# EasyEDA Pro project ProProject_powerboard_ssl_philipp_2023-09-25.epro, schematic Schematic1_1

## Sheets
1 P1: Create Date: 2022-11-08; Page Name: P1; Project Name: powerboard_ssl_philipp; Schematic Name: Schematic1_1; Update Date: 2023-04-02; Company: 嘉立创EDA; Page Size: A4; Version: V1.0
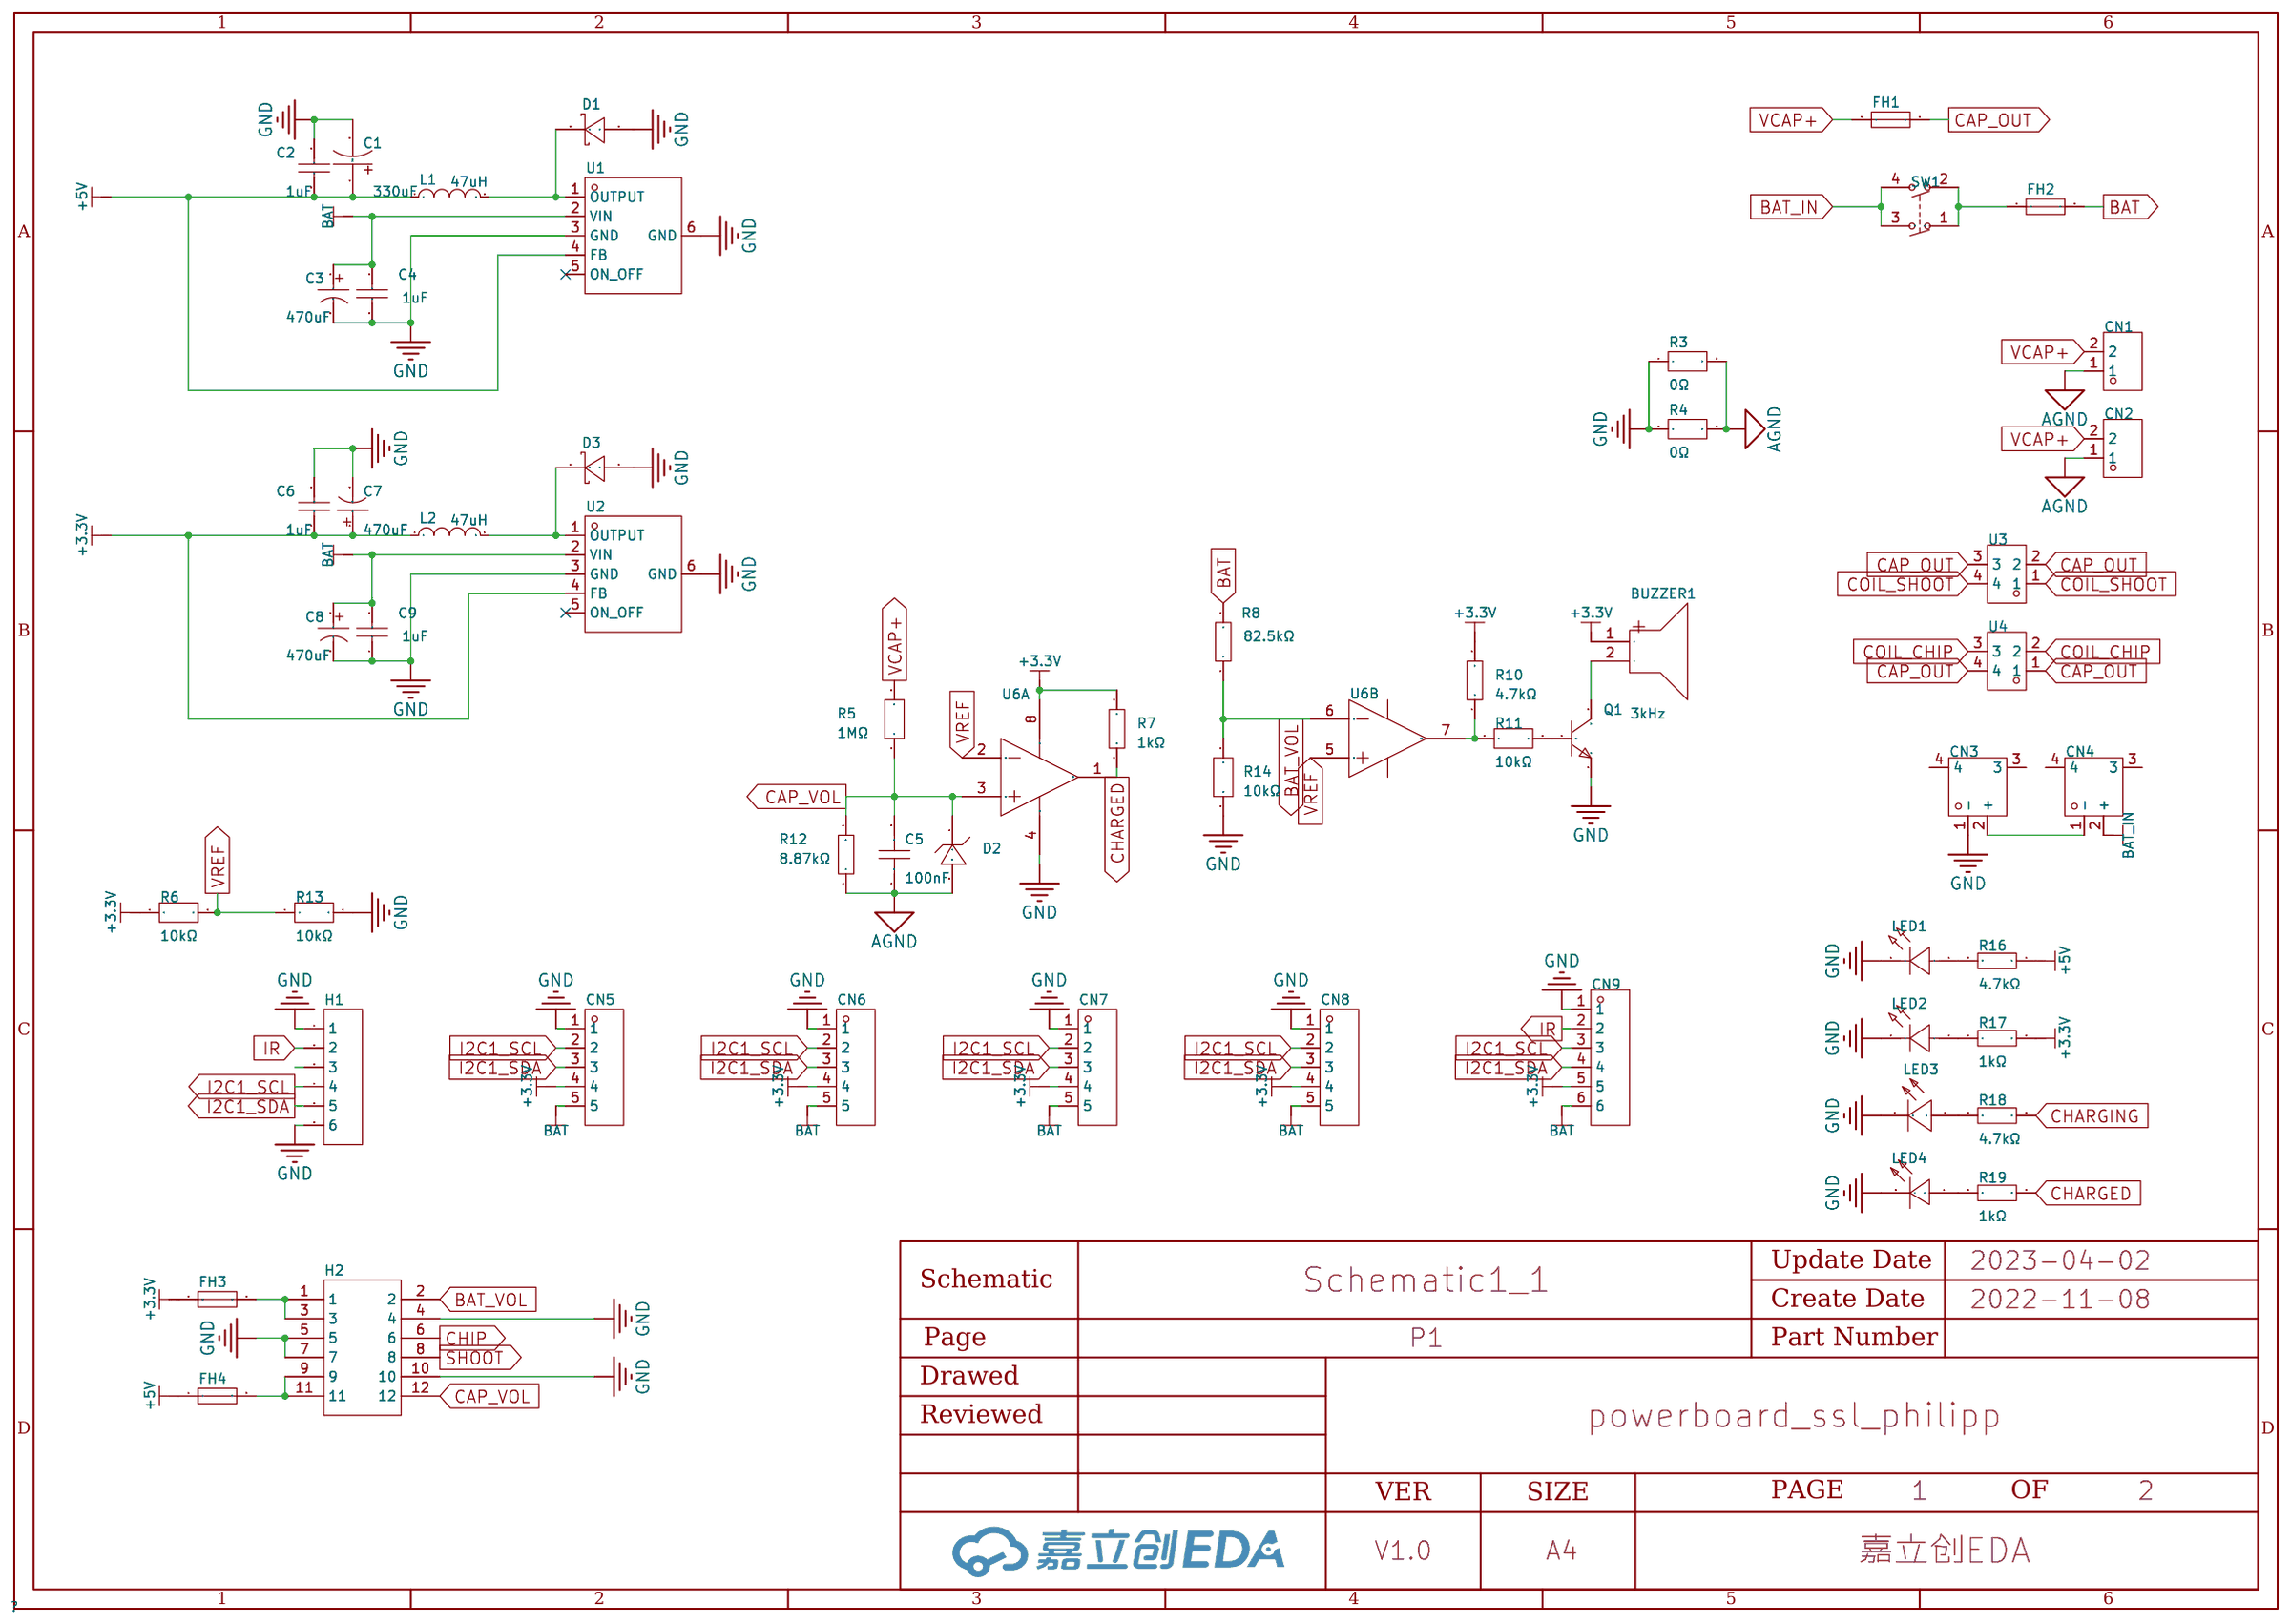
[diagram p16: P1]
2 P2: Create Date: 2022-11-11; Page Name: P2; Update Date: 2023-06-13
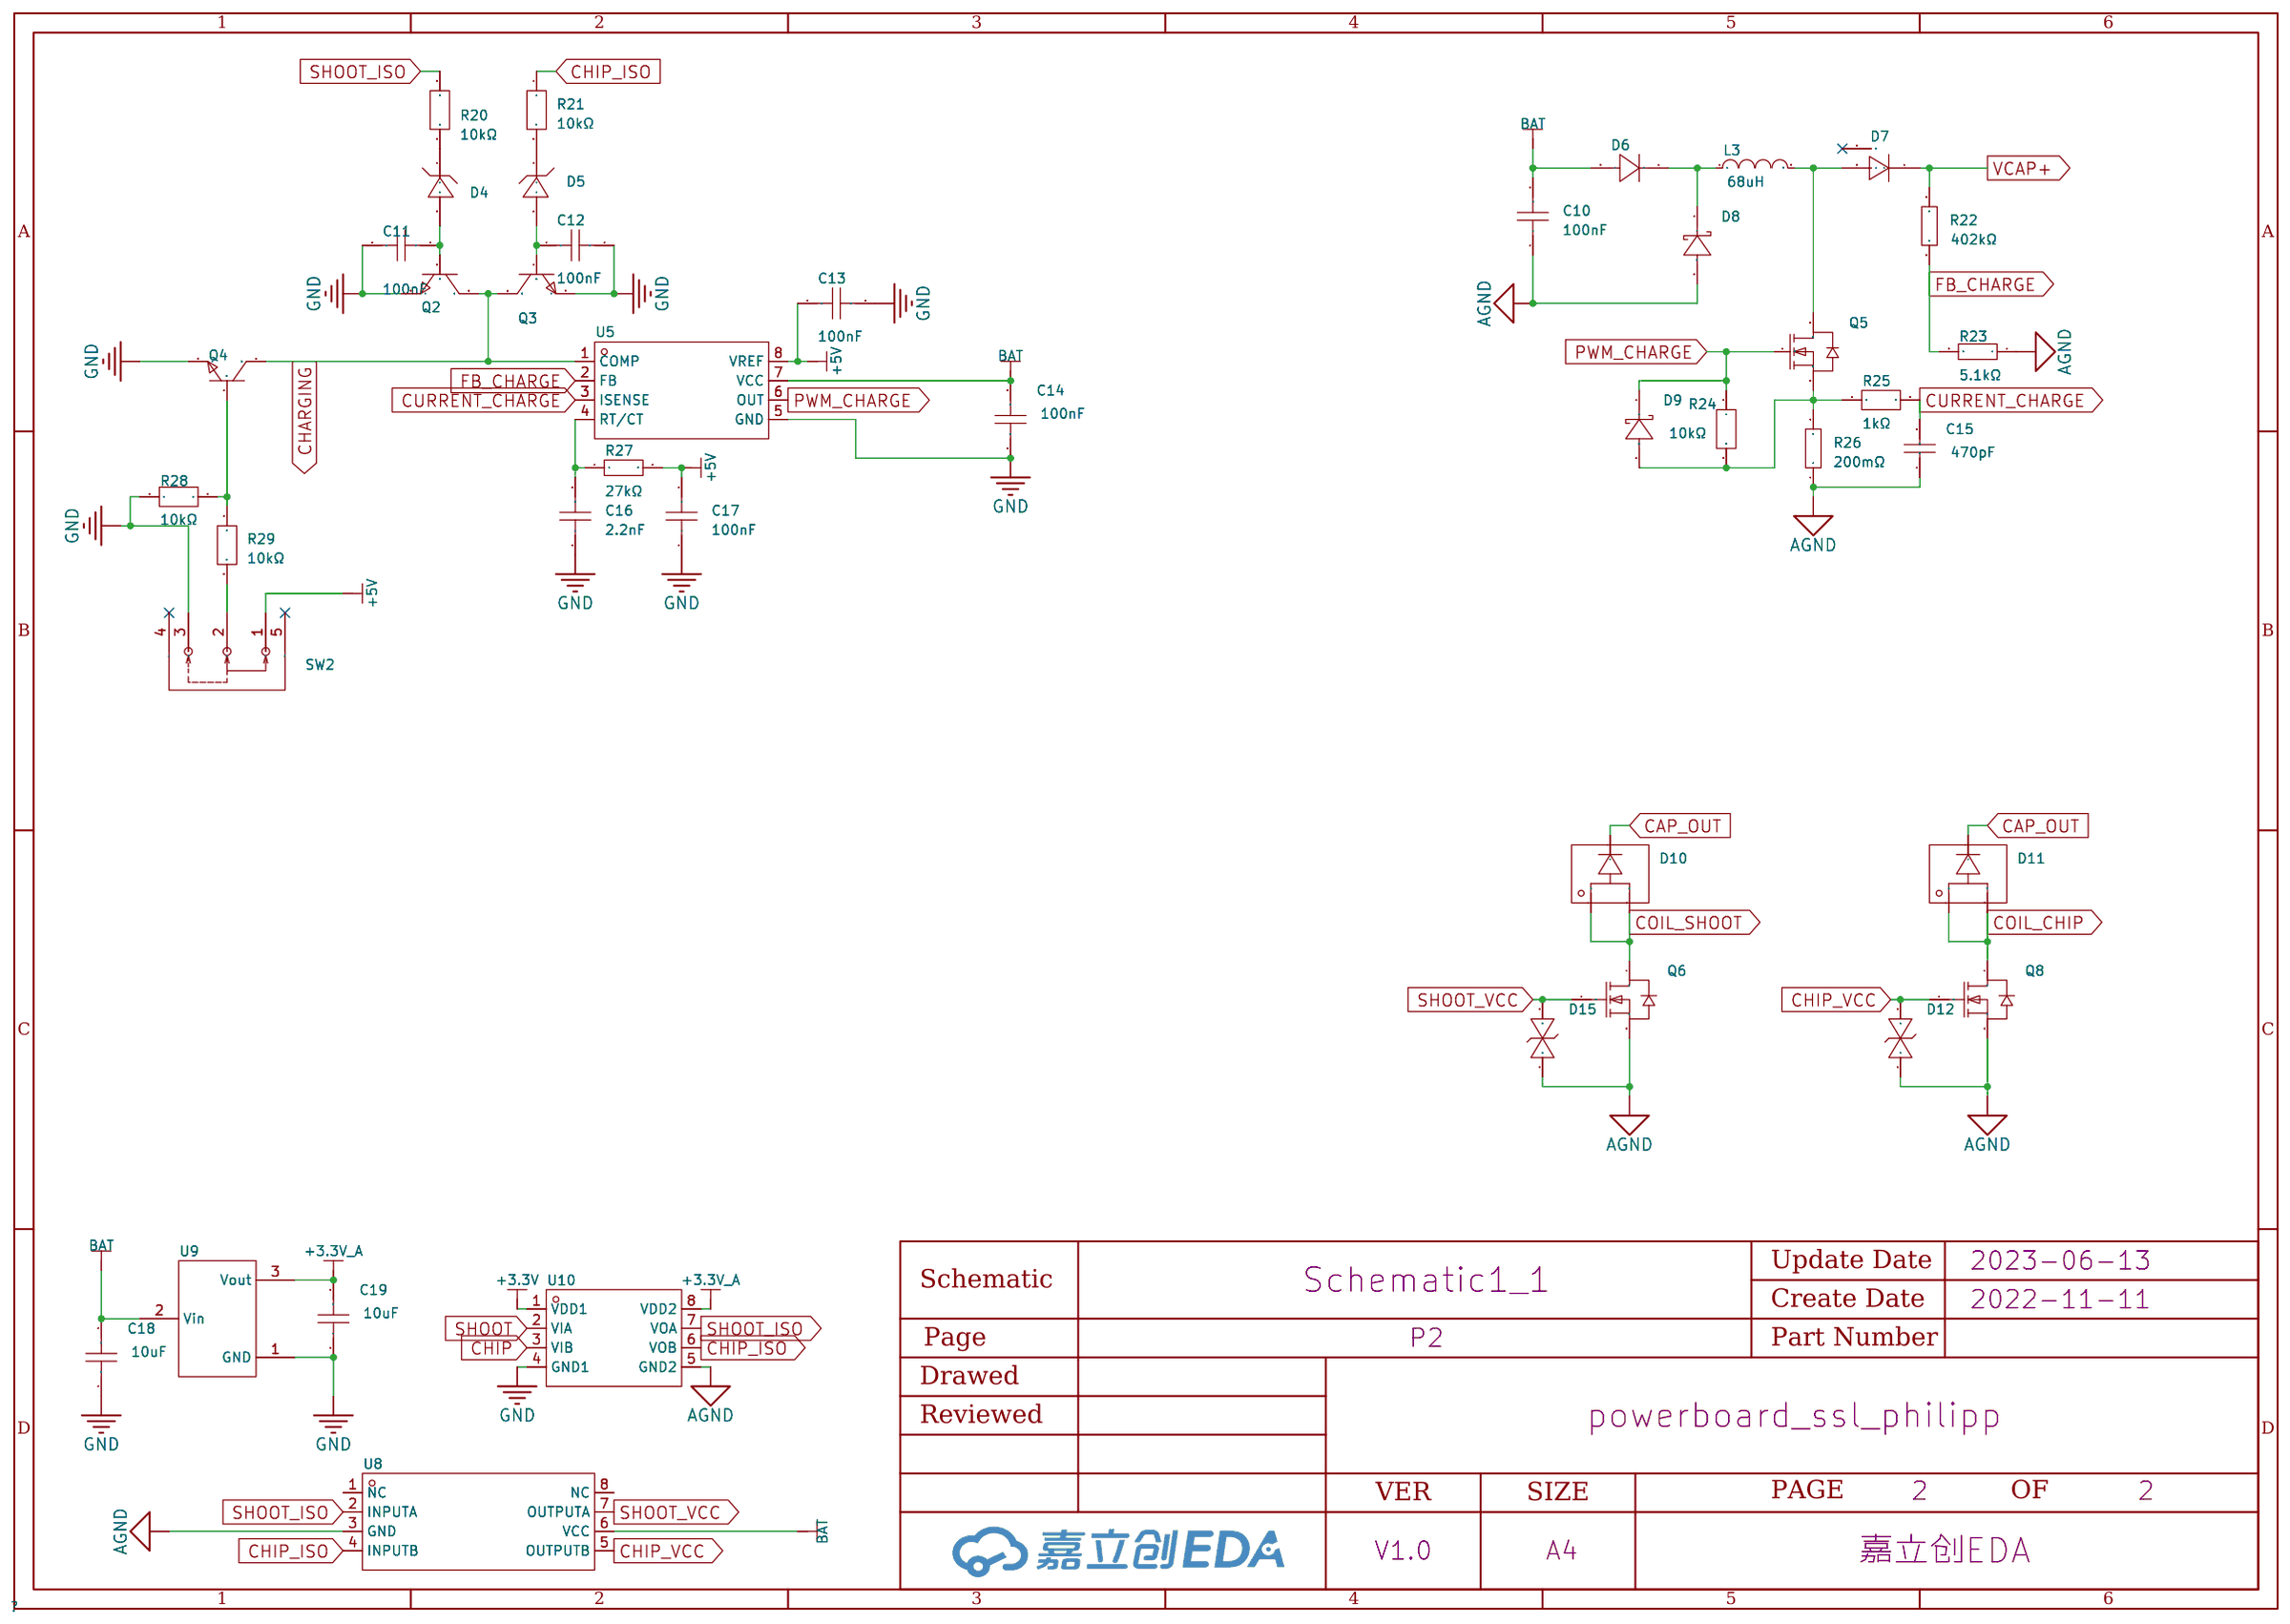
[diagram p17: P2]

## Parts
sheet P1
BUZZER1  3kHz  [BUZ-TH_BD9.0-P5.00-D0.6-FD]
C1  330uF  [CAP-TH_BD8.0-P3.50-D0.6-FD]
C2  1uF  [C0805]
C3  470uF  [CAP-TH_BD10.0-P5.00-D1.0-FD]
C4  1uF  [C0805]
C5  100nF  [C0805]
C6  1uF  [C0805]
C7  470uF  [CAP-TH_BD10.0-P5.00-D1.0-FD]
C8  470uF  [CAP-TH_BD10.0-P5.00-D1.0-FD]
C9  1uF  [C0805]
CN1  OQ0254510000G  [CONN-TH_2P-P25.08_OQ0254510000G]
CN2  OQ0254510000G  [CONN-TH_2P-P25.08_OQ0254510000G]
CN3  XT60PW-M  [CONN-TH_XT60PW-M]
CN4  XT60PW-M  [CONN-TH_XT60PW-M]
CN5  5264-5AWD米色  [CONN-TH_5P-P2.50_5264-5AWD]
CN6  5264-5AWD米色  [CONN-TH_5P-P2.50_5264-5AWD]
CN7  5264-5AWD米色  [CONN-TH_5P-P2.50_5264-5AWD]
CN8  5264-5AWD米色  [CONN-TH_5P-P2.50_5264-5AWD]
CN9  HC-5264-6AW  [CONN-TH_6P-P2.50_HCTL_HC-5264-6AW]
D1  SK32WA  [SOD-123F_L2.8-W1.8-LS3.7-RD]
D2  SMF3.3A  [SOD-123_L2.8-W1.8-LS3.7-RD]
D3  SK32WA  [SOD-123F_L2.8-W1.8-LS3.7-RD]
FH1  01550900M  [FUSE-SMD_L9.8-W5.0]
FH2  01550900M  [FUSE-SMD_L9.8-W5.0]
FH3  01550900M  [FUSE-SMD_L9.8-W5.0]
FH4  01550900M  [FUSE-SMD_L9.8-W5.0]
H1  2.54-1x6P直针  [HDR-TH_6P-P2.54-V-M-1]
H2  A2541WV-2x6P  [HDR-TH_12P-P2.54-V-M-R2-C6-S2.54]
L1  47uH  [IND-SMD_L12.5-W12.5]
L2  47uH  [IND-SMD_L12.5-W12.5]
LED1  MHS171UBCT  [LED-SMD_L2.1-W1.0-R-RD]
LED2  MHS171UBCT  [LED-SMD_L2.1-W1.0-R-RD]
LED3  MHT170UGCT  [LED0805-RD]
LED4  SZYY0805B  [LED0805-R-RD_BLUE]
Q1  SS8050  [SOT-23-3_L2.9-W1.3-P1.90-LS2.4-BR]
R3  0Ω  [R2512]
R4  0Ω  [R2512]
R5  1MΩ  [R0805]
R6  10kΩ  [R0805]
R7  1kΩ  [R0805]
R8  82.5kΩ  [R0805]
R10  4.7kΩ  [R0805]
R11  10kΩ  [R0805]
R12  8.87kΩ  [R0805]
R13  10kΩ  [R0805]
R14  10kΩ  [R0805]
R16  4.7kΩ  [R0805]
R17  1kΩ  [R0805]
R18  4.7kΩ  [R0805]
R19  1kΩ  [R0805]
SW1  SS21-BBIWP2-R  [SW-TH_SS21-BBIWP2]
U1  LM2595S-5.0RG  [TO-263-5_L10.2-W9.9-P1.70-LS14.4-TL]
U2  LM2595S-3.3RG  [TO-263-5_L10.2-W9.9-P1.70-LS14.4-TL]
U3  2061-602/998-404  [CONN-SMD_2061-602-998-404]
U4  2061-602/998-404  [CONN-SMD_2061-602-998-404]
U6  LM393  [SOP-8_L4.9-W3.9-P1.27-LS6.0-BL]  (sections 1,2)
sheet P2
C10  100nF  [C0805]
C11  100nF  [C0805]
C12  100nF  [C0805]
C13  100nF  [C0805]
C14  100nF  [C0805]
C15  470pF  [C1206]
C16  2.2nF  [C1206]
C17  100nF  [C0805]
C18  10uF  [C0805]
C19  10uF  [C0805]
D4  MMSZ9V1T1G  [SOD-123_L2.7-W1.6-LS3.7-RD-3]
D5  MMSZ9V1T1G  [SOD-123_L2.7-W1.6-LS3.7-RD-3]
D6  GS2M  [SMB_L4.5-W3.6-LS5.4-RD]
D7  SFAS805GHMNG  [D2PAK_L10.5-W8.8-P5.08-LS15.2-BL-1]
D8  SMBJ18A  [SMB_L4.4-W3.6-LS5.4-RD]
D9  SMBJ18A  [SMB_L4.4-W3.6-LS5.4-RD]
D10  MBRB40250TG  [D2PAK_L9.1-W10.0-P2.54-LS15.3-BR]
D11  MBRB40250TG  [D2PAK_L9.1-W10.0-P2.54-LS15.3-BR]
D12  SMBJ17CA  [SMB_L4.6-W3.6-LS5.3-BI]
D15  SMBJ17CA  [SMB_L4.6-W3.6-LS5.3-BI]
L3  68uH  [IND-SMD_L12.5-W12.5_SMDRS1255-331M]
Q2  SS8050  [SOT-23-3_L2.9-W1.3-P1.90-LS2.4-BR]
Q3  SS8050  [SOT-23-3_L2.9-W1.3-P1.90-LS2.4-BR]
Q4  SS8050  [SOT-23-3_L2.9-W1.3-P1.90-LS2.4-BR]
Q5  HSU16N25  [TO-252-2_L6.5-W5.6-P4.60-LS9.7-BR-2]
Q6  IRFS4229TRLPBF  [D2PAK_L9.1-W10.0-P2.54-LS15.3-TL]
Q8  IRFS4229TRLPBF  [D2PAK_L9.1-W10.0-P2.54-LS15.3-TL]
R20  10kΩ  [R0805]
R21  10kΩ  [R0805]
R22  402kΩ  [R1206]
R23  5.1kΩ  [R1206]
R24  10kΩ  [R0805]
R25  1kΩ  [R1206]
R26  200mΩ  [R1206]
R27  27kΩ  [R1206]
R28  10kΩ  [R0805]
R29  10kΩ  [R0805]
SW2  SK12D07VG4  [SW-TH_SK12D07VG4]
U5  UC3842B  [SOP-8_L4.9-W3.9-P1.27-LS6.0-BL-1]
U8  MC34152DG  [SOIC-8_L5.0-W4.0-P1.27-LS6.0-BL]
U9  HT7533-1  [SOT-89-3_L4.5-W2.5-P1.50-LS4.2-BR]
U10  120U30  [SOIC-8_L5.0-W4.0-P1.27-LS6.0-BL]

## Library data of the parts
BUZZER1 = HNB09A03: 驱动方式:电磁式;构造类型:有源;额定电压:3V;工作电压:1.5V~4.5V;消耗电流:30mA;频率:3kHz;声压(SPL):85dB@10cm;直径(φD):9mm;长度:-;宽度:-;高度:5.5mm;工作温度:-20~+70;; LCSC Part Name: 电磁式有源一体蜂鸣器HNB09A03; Supplier Part: C96102; Manufacturer: 华能; Supplier Footprint: 插件,P=5mm; JLCPCB Part Class: Extended Part; Datasheet: https://atta.szlcsc.com/upload/public/pdf/source/20170522/1495448326172.pdf; Supplier: LCSC; Oscillator Circuit: 电磁式; Technology Type: 有源; Rated Voltage: 3V; Operating Voltage: 1.5V~4.5V; Current Consumption: 30mA; Sound Pressure Level (SPL): 85dB@10cm; Diameter (φD): 9mm; Height: 5.5mm; Operating Temperature: -20~+70
C1 = EEUFR1E331: 容值:330uF;精度:±20%;额定电压:25V;电容体直径:8mm;电容体长度:11.5mm;脚间距:3.5mm;纹波电流:950mA@100kHz;等效串联电阻:56mΩ@100kHz;工作寿命:6000hrs@105;; LCSC Part Name: 330uF ±20% 25V; Supplier Part: C407891; Manufacturer: PANASONIC(松下); Supplier Footprint: 径向引线,8x11.5mm; JLCPCB Part Class: Extended Part; Datasheet: https://atta.szlcsc.com/upload/public/pdf/source/20190724/C407891_5CA8D9DEE0001D41EB2C74189911EB5A.pdf; Supplier: LCSC; Tolerance: ±20%; Rated Voltage: 25V; φD: 8mm; L: 11.5mm; Lead Spacing: 3.5mm; Ripple Current: 950mA@100kHz; Equivalent Series Resistance(ESR): 56mΩ@100kHz; Lifetime @ Temp: 6000hrs@105
C2 C4 C6 C9 = CL21F105ZAFNNNE: 容值:1uF;精度:-20%~+80%;额定电压:25V;材质(温度系数):Y5V;; LCSC Part Name: 1uF -20%~+80% 25V; Supplier Part: C1761; Manufacturer: SAMSUNG(三星); Supplier Footprint: 0805; JLCPCB Part Class: Extended Part; Datasheet: https://atta.szlcsc.com/upload/public/pdf/source/20160103/1457707695493.pdf; Supplier: LCSC; Tolerance: -20%~+80%; Voltage Rated: 25V; Temperature Coefficient: Y5V
C3 C7 C8 = 25ZLH470MEFC10X12.5: 容值:470uF;精度:±20%;额定电压:25V;电容体直径:10mm;电容体长度:12.5mm;脚间距:5mm;纹波电流:1.33A@100kHz;等效串联电阻:39mΩ@100kHz;工作寿命:10000hrs@105;; LCSC Part Name: 470uF ±20% 25V; Supplier Part: C338188; Manufacturer: rubycon(红宝石); Supplier Footprint: 径向引线,10x12.5mm; JLCPCB Part Class: Extended Part; Datasheet: https://atta.szlcsc.com/upload/public/pdf/source/20181130/C338188_1702E32D76EB3A3EA3A8AEBC54AD098D.pdf; Supplier: LCSC; Tolerance: ±20%; Rated Voltage: 25V; φD: 10mm; L: 12.5mm; Lead Spacing: 5mm; Ripple Current: 1.33A@100kHz; Equivalent Series Resistance(ESR): 39mΩ@100kHz; Lifetime @ Temp: 10000hrs@105
C5 C10-C14 C17 = C0805X104K101T: 温度系数:X7R;容值:100nF;精度:±10%;额定电压:100V;; LCSC Part Name: 100nF(104) ±10% 100V; Supplier Part: C485772; Manufacturer: IHHEC(禾伸堂); Supplier Footprint: 0805; JLCPCB Part Class: Extended Part; Datasheet: https://atta.szlcsc.com/upload/public/pdf/source/20200117/C485772_1C2A03D89DC7D3F931FB9AFBA2903E68.pdf; Supplier: LCSC; Temperature Coefficient: X7R; Tolerance: ±10%; Voltage Rated: 100V
CN1 CN2 = OQ0254510000G: 参考系列:-;间距:5.08mm;插针结构:1x2P;排数:1;每排PIN数:2;行距:-;公母:公型插针;安装方式:弯插;额定电流:20A;工作温度范围:-40~+115;; LCSC Part Name: 2P 5.08mm; Supplier Part: C599410; Manufacturer: Amphenol; Supplier Footprint: 插件,P=5.08mm; JLCPCB Part Class: Extended Part; Datasheet: https://atta.szlcsc.com/upload/public/pdf/source/20210316/C599410_EA23387B2F1C07023878CDA6296B3C6F.pdf; Supplier: LCSC; Pitch: 5.08mm; Pins Structure: 1x2P; Number of Rows: 1; Number of PINs Per Row: 2; Gender: 公型插针; Mounting Style: 弯插; Current Rating (Max): 20A; Operating Temperature Range: -40~+115
CN3 CN4 = XT60PW-M: 模型锂电连接器; LCSC Part Name: XT60PW 公头 板插卧式; Supplier Part: C98732; Manufacturer: AMASS(艾迈斯); Supplier Footprint: Through Hole; JLCPCB Part Class: Extended Part; Datasheet: https://atta.szlcsc.com/upload/public/pdf/source/20180125/C98732_15168617837851301983.pdf; Supplier: LCSC
CN5-CN8 = 5264-5AWD米色: 参考系列:-;间距:2.5mm;插针结构:1x5P;排数:1;每排PIN数:5;行距:-;安装方式:-;触头材质:磷青铜;; LCSC Part Name: 5264插座 1*5P 弯针 带定位; Supplier Part: C176652; Manufacturer: BOOMELE(博穆精密); Supplier Footprint: 插件,P=2.5mm; JLCPCB Part Class: Extended Part; Datasheet: https://atta.szlcsc.com/upload/public/pdf/source/20180125/C176652_15168701824541304803.pdf; Supplier: LCSC; Pitch: 2.5mm; Pins Structure: 1x5P; Number of Rows: 1; Number of PINs Per Row: 5; Contact Material: 磷青铜
CN9 = HC-5264-6AW: 参考系列:-;间距:2.5mm;插针结构:1x6P;排数:1;每排PIN数:6;行距:-;公母:公型插针;安装方式:弯插;额定电流:3A;工作温度范围:-25~+85;; LCSC Part Name: 2.5mm 1x6P 弯插; Supplier Part: C2845829; Manufacturer: HCTL(华灿天禄); Supplier Footprint: 弯插,P=2.5mm; JLCPCB Part Class: Extended Part; Datasheet: https://atta.szlcsc.com/upload/public/pdf/source/20210728/C2845825_8A371A7E0B3DBB1209B365938FCC7945.pdf; Supplier: LCSC; Pitch: 2.5mm; Pins Structure: 1x6P; Number of Rows: 1; Number of PINs Per Row: 6; Gender: 公型插针; Mounting Style: 弯插; Current Rating (Max): 3A; Operating Temperature Range: -25~+85
D1 D3 = SK32WA: 直流反向耐压(Vr):20V;平均整流电流(Io):3A;正向压降(Vf):550mV@3A;; LCSC Part Name: 20V 3A 550mV@3A; Supplier Part: C183472; Manufacturer: SHIKUES(时科); Supplier Footprint: SOD-123F; JLCPCB Part Class: Extended Part; Datasheet: https://atta.szlcsc.com/upload/public/pdf/source/20180323/DA73144C84EC669030D5D10416970BB4.pdf; Supplier: LCSC; Reverse Voltage (Vr): 20V; Average Rectified Current (Io): 3A; Forward Voltage (Vf@If): 550mV@3A
D2 = SMF3.3A: 极性:单向;反向截止电压(Vrwm):3.3V;击穿电压(最小值):5.2V;击穿电压(最大值):6V;反向漏电流(Ir):600A;峰值脉冲电流(Ipp)@10/1000s:25A;最大钳位电压:8V;峰值脉冲功率(Ppp)@10/1000s:200W;; LCSC Part Name: 单向 3.3V 200W; Supplier Part: C283866; Manufacturer: DOWO(东沃); Supplier Footprint: SOD-123; JLCPCB Part Class: Extended Part; Datasheet: https://atta.szlcsc.com/upload/public/pdf/source/20180913/C283866_6B3FC7DB82D40F63EC323F6A8CE1774A.pdf; Supplier: LCSC; Polarity: 单向; Reverse Stand-Off Voltage (Vrwm): 3.3V; Breakdown Voltage (Min): 5.2V; Breakdown Voltage (Max): 6V; Reverse Leakage Current (Ir): 600A; Peak Pulse Current (Ipp)@10/1000μs: 25A; Maximum Clamping Voltage: 8V; Peak Pulse Power Dissipation (Ppp)@10/1000μs: 200W
FH1-FH4 = 01550900M: 保险丝座类型:-;保险丝类型:-;配套使用产品/相关产品:-;保险丝尺寸:-;电路数:-;; Supplier Part: C108518; Manufacturer: Littelfuse(美国力特); Supplier Footprint: SMD,9.73x5.03mm; JLCPCB Part Class: Extended Part; Datasheet: https://atta.szlcsc.com/upload/public/pdf/source/20180709/C108518_633006668DA33DEF5C52F8FE2F1C83D6.pdf; Supplier: LCSC
H1 = 2.54-1x6P直针: 间距:2.54mm;总PIN位数:6;排数:1;插针结构:1x6P;行距:-;安装类型:直插;圆针/方针:方针;额定电流:3A;额定电压:-;配合针长度:-;塑高:-;触头材质:黄铜;触头镀层:-;工作温度范围:-40~+105;颜色:黑色;; LCSC Part Name: 2.54mm 1x6P 直插 方针; Supplier Part: C37208; Manufacturer: BOOMELE(博穆精密); Supplier Footprint: 直插,P=2.54mm; JLCPCB Part Class: Extended Part; Datasheet: https://atta.szlcsc.com/upload/public/pdf/source/20151109/1457707558014.pdf; Supplier: LCSC; Pitch: 2.54mm; Number of Pins: 6; Number of Rows: 1; Pin Structure: 1x6P; Mounting Type: 直插; Circluar Pins/Square Pins: 方针; Current Rating (Max): 3A; Contact Material: 黄铜; Operating Temperature Range: -40~+105; Color: 黑色
H2 = A2541WV-2x6P: 间距:2.54mm;总PIN位数:12;排数:2;插针结构:2x6P;行距:2.54mm;安装类型:直插;圆针/方针:方针;额定电流:-;额定电压:-;配合针长度:6mm;塑高:2.54mm;端接针长度:3mm;触头材质:黄铜;触头镀层:-;工作温度范围:-40~+105;颜色:黑色;; LCSC Part Name: 2.54mm 2x6P 直插 方针 镀金; Supplier Part: C225521; Manufacturer: CJT(长江连接器); Supplier Footprint: 插件,P=2.54mm; JLCPCB Part Class: Extended Part; Datasheet: https://atta.szlcsc.com/upload/public/pdf/source/20180509/C225521_5ACF74447E0551B122D29D93138E3088.pdf; Supplier: LCSC; Pitch: 2.54mm; Number of Pins: 12; Number of Rows: 2; Pin Structure: 2x6P; Row Spacing: 2.54mm; Mounting Type: 直插; Circluar Pins/Square Pins: 方针; Length of Mating Pin: 6mm; Insulation Height: 2.54mm; Length of End Connection Pin: 3mm; Contact Material: 黄铜; Operating Temperature Range: -40~+105; Color: 黑色
L1 L2 = MBH125-470M: 电感值:47uH;; Supplier Part: C2981394; Manufacturer: COILMX(迈翔科技); Supplier Footprint: SMD,12.5x12.5x6mm; JLCPCB Part Class: Extended Part; Datasheet: https://atta.szlcsc.com/upload/public/pdf/source/20220311/55EE69307157DBD1A26B3C01E18946AF.pdf; Supplier: LCSC
LED1 LED2 = MHS171UBCT: 发光颜色:蓝灯;二极管配置:-;透镜颜色:无色透明;主波长:467nm~476nm;峰值波长:468nm;色温:-;光通量(25时):-;测试电流:5mA;正向电压(VF):3.1V;发光强度:90mcd;功率:75mW;发光角度:140°;安装方式:侧贴;工作温度:-40~+85;; LCSC Part Name: 0805侧贴蓝色光; Supplier Part: C693906; Manufacturer: MEIHUA(美华); Supplier Footprint: 0805; JLCPCB Part Class: Extended Part; Datasheet: https://atta.szlcsc.com/upload/public/pdf/source/20200629/C693906_2892460FD04527E9A85093334938F5D1.pdf; Supplier: LCSC; Emitted Color: 蓝灯; Lens Color: 无色透明; Dominant Wavelength: 467nm~476nm; Peak Wavelength: 468nm; Forward Current: 5mA; Forward Voltage (VF): 3.1V; Luminous Intensity: 90mcd; Power Dissipation: 75mW; Viewing Angle: 140°; Mounting Sytle: 侧贴; Operating Temperature: -40~+85
LED3 = MHT170UGCT: 发光颜色:翠绿;二极管配置:-;透镜颜色:无色透明;主波长:517.5nm~527.5nm;峰值波长:518nm;色温:-;光通量(25时):-;测试电流:20mA;正向电压(VF):3.3V;发光强度:900mcd;功率:95mW;发光角度:140°;安装方式:-;工作温度:-40~+85;; LCSC Part Name: 0805正贴翠绿色光1.1T; Supplier Part: C397047; Manufacturer: MEIHUA(美华); Supplier Footprint: 0805; JLCPCB Part Class: Extended Part; Datasheet: https://atta.szlcsc.com/upload/public/pdf/source/20190613/C397047_2A22FA6439BE28969F43FCCFADF75FF7.pdf; Supplier: LCSC; Emitted Color: 翠绿; Lens Color: 无色透明; Dominant Wavelength: 517.5nm~527.5nm; Peak Wavelength: 518nm; Forward Current: 20mA; Forward Voltage (VF): 3.3V; Luminous Intensity: 900mcd; Power Dissipation: 95mW; Viewing Angle: 140°; Operating Temperature: -40~+85
LED4 = SZYY0805B: 发光颜色:蓝灯;二极管配置:-;透镜颜色:无色透明;主波长:460nm~475nm;峰值波长:469nm;色温:-;光通量(25时):-;测试电流:5mA;正向电压(VF):3.1V;发光强度:100mcd;功率:100mW;发光角度:120°;安装方式:-;工作温度:-40~+85;; LCSC Part Name: 蓝灯; Supplier Part: C434433; Manufacturer: yongyu(永裕光电); Supplier Footprint: 0805; JLCPCB Part Class: Extended Part; Datasheet: https://atta.szlcsc.com/upload/public/pdf/source/20191204/C434433_0B90CAB876449C52BDD12D5E48F83BBD.pdf; Supplier: LCSC; Emitted Color: 蓝灯; Lens Color: 无色透明; Dominant Wavelength: 460nm~475nm; Peak Wavelength: 469nm; Forward Current: 5mA; Forward Voltage (VF): 3.1V; Luminous Intensity: 100mcd; Power Dissipation: 100mW; Viewing Angle: 120°; Operating Temperature: -40~+85
Q1-Q4 = SS8050_C2150: 晶体管类型:NPN;集射极击穿电压(Vceo):25V;集电极电流(Ic):1.5A;功率(Pd):300mW;集电极-发射极饱和电压(VCE(sat)@Ic,Ib):500mV@800mA,80mA;直流电流增益(hFE@Ic,Vce):200@100mA,1V;特征频率(fT):100MHz;工作温度:+150@(Tj);; LCSC Part Name: SS8050 Y1 200-350 Y1 200-350; Supplier Part: C2150; Manufacturer: CJ(江苏长电/长晶); Supplier Footprint: SOT-23(SOT-23-3); JLCPCB Part Class: Basic Part; Datasheet: https://atta.szlcsc.com/upload/public/pdf/source/20140809/1457707209319.pdf; Supplier: LCSC; Transistor Type: NPN; Collector-Emitter Breakdown Voltage (Vceo): 25V; Collector Current (Ic): 1.5A; Power Dissipation (Pd): 300mW; Collector-Emitter Saturation Voltage (VCE(sat)@Ic,Ib): 500mV@800mA,80mA; DC Current Gain (hFE@Ic,Vce): 200@100mA,1V; Transition Frequency (fT): 100MHz; Operating Temperature: +150@(Tj)
R3 R4 = RC-120000FT: 阻值:0Ω;; Supplier Part: C723334; Manufacturer: FH(风华); Supplier Footprint: 2512; JLCPCB Part Class: Extended Part; Datasheet: https://atta.szlcsc.com/upload/public/pdf/source/20201030/C723334_CEBDDAA37AC0E15E2289D0B9B7A9F653.pdf; Supplier: LCSC
R5 = CR0805F1M00P05Z: 阻值:1MΩ;精度:±1%;功率:125mW;温度系数:±100ppm/;; LCSC Part Name: 1MΩ ±1% 125mW; Supplier Part: C881016; Manufacturer: EVER OHMS(天二科技); Supplier Footprint: 0805; JLCPCB Part Class: Extended Part; Datasheet: https://atta.szlcsc.com/upload/public/pdf/source/20201014/C881429_ABC29D63C8D6A11EB63D87348B25AA7B.pdf; Supplier: LCSC; Tolerance: ±1%; Power(Watts): 125mW; Temperature Coefficient: ±100ppm/
R6 R11 R13 R14 R20 R21 R24 R28 R29 = ARG05FTD1002: 阻值:10kΩ;精度:±1%;温度系数:±50ppm/;; LCSC Part Name: 10kΩ ±1%; Supplier Part: C2828859; Manufacturer: Viking(光颉); Supplier Footprint: 0805; JLCPCB Part Class: Extended Part; Datasheet: https://atta.szlcsc.com/upload/public/pdf/source/20200117/C485675_99063924B4564AF910B7BE66DA8EFA49.pdf; Supplier: LCSC; Tolerance: ±1%; Temperature Coefficient: ±50ppm/
R7 R17 R19 = QR0805F1K00P05Z: 电阻类型:厚膜电阻;阻值:1kΩ;精度:±1%;功率:125mW;温度系数:±100ppm/;最大工作电压:150V;工作温度范围:-55~+155;; LCSC Part Name: 1kΩ ±1%; Supplier Part: C176197; Manufacturer: EVER OHMS(天二科技); Supplier Footprint: 0805; JLCPCB Part Class: Extended Part; Datasheet: https://atta.szlcsc.com/upload/public/pdf/source/20190415/C176197_C60CBF18F0A7636F3DFA0D4EFA05F988.pdf; Supplier: LCSC; Type: 厚膜电阻; Tolerance: ±1%; Power(Watts): 125mW; Temperature Coefficient: ±100ppm/; Overload Voltage (Max): 150V; Operating Temperature Range: -55~+155
R8 = 0805W8F8252T5E: 电阻类型:厚膜电阻;阻值:82.5kΩ;精度:±1%;功率:125mW;温度系数:±100ppm/;最大工作电压:150V;工作温度范围:-55~+155;; LCSC Part Name: 82.5kΩ ±1% 125mW; Supplier Part: C17835; Manufacturer: UNI-ROYAL(厚声); Supplier Footprint: 0805; JLCPCB Part Class: Extended Part; Datasheet: https://atta.szlcsc.com/upload/public/pdf/source/20200306/C422600_1E6D84923E4A46A82E41ADD87F860B5C.pdf; Supplier: LCSC; Type: 厚膜电阻; Tolerance: ±1%; Power(Watts): 125mW; Temperature Coefficient: ±100ppm/; Overload Voltage (Max): 150V; Operating Temperature Range: -55~+155
R10 R16 R18 = RMC08054.7K1%N: 阻值:4.7kΩ;精度:±1%;功率:125mW;; LCSC Part Name: 4.7kΩ ±1% 125mW; Supplier Part: C269746; Manufacturer: Tyohm(幸亚电阻); Supplier Footprint: 0805; JLCPCB Part Class: Extended Part; Datasheet: https://atta.szlcsc.com/upload/public/pdf/source/20190115/C269746_3EA3C7E4490C68712FA44CA03852E2BD.pdf; Supplier: LCSC; Tolerance: ±1%; Power(Watts): 125mW
R12 = RTT058871FTP: 电阻类型:厚膜电阻;阻值:8.87kΩ;精度:±1%;功率:125mW;温度系数:±100ppm/;最大工作电压:150V;工作温度范围:-55~+155;; LCSC Part Name: 8.87kΩ ±1% 125mW; Supplier Part: C104543; Manufacturer: RALEC(旺诠); Supplier Footprint: 0805; JLCPCB Part Class: Extended Part; Datasheet: https://atta.szlcsc.com/upload/public/pdf/source/20170408/1491646636381.pdf; Supplier: LCSC; Type: 厚膜电阻; Tolerance: ±1%; Power(Watts): 125mW; Temperature Coefficient: ±100ppm/; Overload Voltage (Max): 150V; Operating Temperature Range: -55~+155
SW1 = SS21-BBIWP2-R: LCSC Part Name: 跷板开关DPST 15x21mm; Supplier Part: C309182; Manufacturer: Legion(六钧); Supplier Footprint: 插件; JLCPCB Part Class: Extended Part; Datasheet: https://atta.szlcsc.com/upload/public/pdf/source/20190311/C309182_BE3155CDE2291F8D537E9264D9294CC5.pdf; Supplier: LCSC
U1 = LM2595S-5.0RG: 输出电压:5V;输出电流(最大值):3A;开关频率:150kHz;; LCSC Part Name: Vout=5V 3A; Supplier Part: C5145315; Manufacturer: HGC(深圳汉芯); Supplier Footprint: TO-263-5L; Datasheet: https://atta.szlcsc.com/upload/public/pdf/source/20221014/41DB573108F8F48E0FF3640935E27223.pdf; Supplier: LCSC; Output Voltage: 5V; Output Current (Max): 3A; Switching Frequency: 150kHz
U2 = LM2595S-3.3RG: 输出电压:3.3V;输出电流(最大值):3A;开关频率:150kHz;; LCSC Part Name: Vout=3.3V 3A; Supplier Part: C5145316; Manufacturer: HGC(深圳汉芯); Supplier Footprint: TO-263-5L; Datasheet: https://atta.szlcsc.com/upload/public/pdf/source/20221014/41DB573108F8F48E0FF3640935E27223.pdf; Supplier: LCSC; Output Voltage: 3.3V; Output Current (Max): 3A; Switching Frequency: 150kHz
U3 U4 = 2061-602/998-404: 间距:6mm;每排PIN数:2;排数:1;安装类型:表面贴装;额定电流:-;额定电压:-;线规 - AWG:-;线规 - mm²:-;工作温度范围:-60~+105;颜色:白色;; LCSC Part Name: 6mm 每排P数:2 排数:1; Supplier Part: C2765058; Manufacturer: WAGO(万可); Supplier Footprint: P=6mm; JLCPCB Part Class: Extended Part; Datasheet: https://atta.szlcsc.com/upload/public/pdf/source/20210406/C2765058_42F16AD0A4D4755D149E55C8B45DF4E1.pdf; Supplier: LCSC; Pitch: 6mm; Number of PINs Per Row: 2; Number of Rows: 1; Mounting Style: 表面贴装; Operating Temperature Range: -60~+105; Color: 白色
U6 = LM393_C400839: 比较器组数:-;电源电压:-;各通道供电电流:-;输出类型:-;传播延迟:-;; Supplier Part: C400839; Manufacturer: IDCHIP(英锐芯); Supplier Footprint: SOP-8; JLCPCB Part Class: Extended Part; Datasheet: https://atta.szlcsc.com/upload/public/pdf/source/20190624/C400839_FC3E4757065A64BC24F9F0B8EF99EFFB.pdf; Supplier: LCSC
C15 = CC1206KKX7RCBB471: 容值:470pF;精度:±10%;额定电压:1kV;材质(温度系数):X7R;; LCSC Part Name: 470pF ±10% 1kV; Supplier Part: C107197; Manufacturer: YAGEO(国巨); Supplier Footprint: 1206; JLCPCB Part Class: Extended Part; Datasheet: https://atta.szlcsc.com/upload/public/pdf/source/20170420/1492670778345.pdf; Supplier: LCSC; Tolerance: ±10%; Voltage Rated: 1kV; Temperature Coefficient: X7R
C16 = 1206B222K501NT: 容值:2.2nF;精度:±10%;额定电压:500V;材质(温度系数):-;; LCSC Part Name: 2.2nF ±10% 500V; Supplier Part: C2762224; Manufacturer: FH(风华); Supplier Footprint: 1206; JLCPCB Part Class: Extended Part; Datasheet: https://atta.szlcsc.com/upload/public/pdf/source/20200305/C486355_26A10D38EF8C2A5C37091D0039909270.pdf; Supplier: LCSC; Tolerance: ±10%; Voltage Rated: 500V
C18 C19 = GRM21BR61E106KA73L: 容值:10uF;精度:±10%;额定电压:25V;材质(温度系数):X5R;; LCSC Part Name: 10uF ±10% 25V; Supplier Part: C84416; Manufacturer: muRata(村田); Supplier Footprint: 0805; JLCPCB Part Class: Extended Part; Datasheet: https://atta.szlcsc.com/upload/public/pdf/source/20161024/1477288633268.pdf; Supplier: LCSC; Tolerance: ±10%; Voltage Rated: 25V; Temperature Coefficient: X5R
D4 D5 = MMSZ9V1T1G: 二极管配置:独立式;稳压值(标称值):9.1V;稳压值(范围):8.65V~9.56V;精度:±5%;功率:500mW;反向电流(Ir):500nA@6V;阻抗(Zzt):15Ω;; LCSC Part Name: MMSZ: 500 mW; 5% Zener Diode Voltage Regulator; Supplier Part: C132795; Manufacturer: onsemi(安森美); Supplier Footprint: SOD-123; JLCPCB Part Class: Extended Part; Datasheet: https://atta.szlcsc.com/upload/public/pdf/source/20171113/C132795_15105610757681115435.PDF; Supplier: LCSC; Diode Configuration: 独立式; Zener Voltage (Nom): 9.1V; Zener Voltage (Range): 8.65V~9.56V; Tolerance: ±5%; Power Dissipation: 500mW; Reverse Leakage Current (Ir): 500nA@6V; Zener Impedance (Zzt): 15Ω
D6 = GS2M_C698618: 二极管配置:独立式;直流反向耐压(Vr):1.2kV;平均整流电流(Io):2A;正向压降(Vf):1.15V@2A;反向电流(Ir):5A@1.2kV;; LCSC Part Name: 1.2kV 2A 1.15V@2A; Supplier Part: C698618; Manufacturer: YANGJIE(扬杰); Supplier Footprint: SMB(DO-214AA); JLCPCB Part Class: Extended Part; Datasheet: https://atta.szlcsc.com/upload/public/pdf/source/20200713/C698618_86B926E1828E5318C037A757CDD1E7A6.pdf; Supplier: LCSC; Diode Configuration: 独立式; Reverse Voltage (Vr): 1.2kV; Average Rectified Current (Io): 2A; Forward Voltage (Vf@If): 1.15V@2A; Reverse Leakage Current: 5A@1.2kV
D7 = SFAS805GHMNG: 二极管配置:独立式;直流反向耐压(Vr):300V;平均整流电流(Io):8A;正向压降(Vf):1.3V@8A;反向电流(Ir):10A@300V;反向恢复时间(trr):35ns;工作温度:-55~+150@(Tj);; LCSC Part Name: 300V 8A 35ns; Supplier Part: C485062; Manufacturer: Taiwan Semiconductor(台湾半导体); Supplier Footprint: D2PAK; JLCPCB Part Class: Extended Part; Datasheet: https://atta.szlcsc.com/upload/public/pdf/source/20200115/C485062_B79A1ADFAD0BAD1AD5A8CBB94A6C5BFE.pdf; Supplier: LCSC; Diode Configuration: 独立式; Reverse Voltage (Vr): 300V; Average Rectified Current (Io): 8A; Forward Voltage (Vf@If): 1.3V@8A; Reverse Leakage Current: 10A@300V; Reverse Recovery Time (trr): 35ns; Operating Temperature: -55~+150@(Tj)
D8 D9 = SMBJ18A_C693494: 极性:单向;反向截止电压(Vrwm):18V;击穿电压(最小值):29.2V;峰值脉冲电流(Ipp)@10/1000s:20.6A;最大钳位电压:29.2V;; LCSC Part Name: 单向 18V; Supplier Part: C693494; Manufacturer: FTR(乔光电子); Supplier Footprint: SMB(DO-214AA); JLCPCB Part Class: Extended Part; Datasheet: https://atta.szlcsc.com/upload/public/pdf/source/20200701/C693490_2A1922FF33BB98835C22E740F3EF18EC.pdf; Supplier: LCSC; Polarity: 单向; Reverse Stand-Off Voltage (Vrwm): 18V; Breakdown Voltage (Min): 29.2V; Peak Pulse Current (Ipp)@10/1000μs: 20.6A; Maximum Clamping Voltage: 29.2V
D10 D11 = MBRB40250TG: 直流反向耐压(Vr):250V;平均整流电流(Io):40A;正向压降(Vf):970mV@40A;; LCSC Part Name: MBRB40250TG: Schottky Power Rectifier, Switch-mode, 40 A, 250 V; Supplier Part: C480682; Manufacturer: onsemi(安森美); Supplier Footprint: D2PAK; JLCPCB Part Class: Extended Part; Datasheet: https://atta.szlcsc.com/upload/public/pdf/source/20200107/C480682_A322012E1593558B56C3AAF032477157.pdf; Supplier: LCSC; Reverse Voltage (Vr): 250V; Average Rectified Current (Io): 40A; Forward Voltage (Vf@If): 970mV@40A
D12 D15 = SMBJ17CA_C726866: 极性:双向;; LCSC Part Name: 双向; Supplier Part: C726866; Manufacturer: TWGMC(台湾迪嘉); Supplier Footprint: SMB; JLCPCB Part Class: Extended Part; Datasheet: https://atta.szlcsc.com/upload/public/pdf/source/20200901/C726811_07201DC3516E92FF13903A0BAE18F725.pdf; Supplier: LCSC; Polarity: 双向
L3 = YSLF1275-680M: 电感值:68uH;精度:±20%;额定电流:2A;直流电阻(DCR):94mΩ;; LCSC Part Name: 68uH ±20% 2A 94mΩ; Supplier Part: C693899; Manufacturer: YJYCOIN(益嘉源); Supplier Footprint: SMD,12.5x12.5x7.5mm; JLCPCB Part Class: Extended Part; Datasheet: https://atta.szlcsc.com/upload/public/pdf/source/20200629/C693893_82097FFA6D41E3DD06289E0102D7BD95.pdf; Supplier: LCSC; Tolerance: ±20%; Rated Current: 2A; DC Resistance (DCR): 94mΩ
Q5 = HSU16N25: 类型:N沟道;漏源电压(Vdss):250V;连续漏极电流(Id):16A;功率(Pd):35W;导通电阻(RDS(on)@Vgs,Id):250mΩ@10V,8A;阈值电压(Vgs(th)@Id):4.0V@250A;; LCSC Part Name: N沟道 250V 16A; Supplier Part: C845615; Manufacturer: HUASHUO(华朔); Supplier Footprint: TO-252; JLCPCB Part Class: Extended Part; Datasheet: https://atta.szlcsc.com/upload/public/pdf/source/20201013/C845615_DFBA45AB3989AC818C53D1908ECC7454.pdf; Supplier: LCSC; Type: N沟道; Drain Source Voltage (Vdss): 250V; Continuous Drain Current (Id): 16A; Power Dissipation (Pd): 35W; Drain Source On Resistance (RDS(on)@Vgs,Id): 250mΩ@10V,8A; Gate Threshold Voltage (Vgs(th)@Id): 4.0V@250A
Q6 Q8 = IRFS4229TRLPBF: 类型:N沟道;漏源电压(Vdss):250V;连续漏极电流(Id):45A;功率(Pd):330W;导通电阻(RDS(on)@Vgs,Id):48mΩ@10V,26A;阈值电压(Vgs(th)@Id):2.4V@39A;; LCSC Part Name: N沟道 250V 45A; Supplier Part: C538018; Manufacturer: Infineon(英飞凌); Supplier Footprint: D2PAK; JLCPCB Part Class: Extended Part; Datasheet: https://atta.szlcsc.com/upload/public/pdf/source/20200525/C538018_98AAC0ECC47916D06978020247764DBD.pdf; Supplier: LCSC; Type: N沟道; Drain Source Voltage (Vdss): 250V; Continuous Drain Current (Id): 45A; Power Dissipation (Pd): 330W; Drain Source On Resistance (RDS(on)@Vgs,Id): 48mΩ@10V,26A; Gate Threshold Voltage (Vgs(th)@Id): 2.4V@39A
R22 = AC1206FR-07402KL: 功率:250mW;电阻长:-;精度:±1%;工作温度范围:-55~+155;电阻直径:-;阻值:402kΩ;电阻高:-;电阻宽:-;电阻类型:厚膜电阻;温度系数:±100ppm/;最大工作电压:200V;; LCSC Part Name: 402kΩ ±1%; Supplier Part: C229624; Manufacturer: YAGEO(国巨); Supplier Footprint: 1206; JLCPCB Part Class: Extended Part; Datasheet: https://atta.szlcsc.com/upload/public/pdf/source/20180906/C229624_0841C9E82D7EFBD7D2122D77D983752E.pdf; Supplier: LCSC; Power(Watts): 250mW; Tolerance: ±1%; Operating Temperature Range: -55~+155; Type: 厚膜电阻; Temperature Coefficient: ±100ppm/; Overload Voltage (Max): 200V
R23 = RMC12065.1K1%N: 阻值:5.1kΩ;精度:±1%;功率:250mW;; LCSC Part Name: 5.1kΩ ±1% 250mW; Supplier Part: C325932; Manufacturer: Tyohm(幸亚电阻); Supplier Footprint: 1206; JLCPCB Part Class: Extended Part; Datasheet: https://atta.szlcsc.com/upload/public/pdf/source/20190115/C325932_B7F1D57DC8EA01BCBCABEF363C402854.pdf; Supplier: LCSC; Tolerance: ±1%; Power(Watts): 250mW
R25 = HV06W4F1001T5E: 精度:±1%;温度系数:±100ppm/;功率:1/4W;阻值:1kΩ;最大工作电压:500V;工作温度范围:-55~+155;; LCSC Part Name: 1KΩ ±1%; Supplier Part: C414808; Manufacturer: UNI-ROYAL(厚声); Supplier Footprint: 1206; JLCPCB Part Class: Extended Part; Datasheet: https://atta.szlcsc.com/upload/public/pdf/source/20190827/C414808_28BD918F26DF150E6C191E0EFB710C5D.pdf; Supplier: LCSC; Tolerance: ±1%; Temperature Coefficient: ±100ppm/; Power(Watts): 1/4W; Overload Voltage (Max): 500V; Operating Temperature Range: -55~+155
R26 = 1206W4F200LT5E: 电阻类型:厚膜电阻;阻值:200mΩ;精度:±1%;功率:250mW;温度系数:±800ppm/;最大工作电压:200V;工作温度范围:-55~+155;; LCSC Part Name: 200mΩ ±1% 250mW; Supplier Part: C25335; Manufacturer: UNI-ROYAL(厚声); Supplier Footprint: 1206; JLCPCB Part Class: Extended Part; Datasheet: https://atta.szlcsc.com/upload/public/pdf/source/20200306/C422600_1E6D84923E4A46A82E41ADD87F860B5C.pdf; Supplier: LCSC; Type: 厚膜电阻; Tolerance: ±1%; Power(Watts): 250mW; Temperature Coefficient: ±800ppm/; Overload Voltage (Max): 200V; Operating Temperature Range: -55~+155
R27 = WR12X2702FTL: 阻值:27kΩ;精度:±1%;功率:250mW;温度系数:±100ppm/;最大工作电压:200V;工作温度范围:-55~+155;; LCSC Part Name: 27kΩ ±1%; Supplier Part: C171077; Manufacturer: 华新科(Walsin); Supplier Footprint: 1206; JLCPCB Part Class: Extended Part; Datasheet: https://atta.szlcsc.com/upload/public/pdf/source/20180125/C171077_15168698985411304382.pdf; Supplier: LCSC; Tolerance: ±1%; Power(Watts): 250mW; Temperature Coefficient: ±100ppm/; Overload Voltage (Max): 200V; Operating Temperature Range: -55~+155
SW2 = SK12D07VG4: 额定电流(DC):500mA;额定电压(DC):50V;额定电流(AC):-;额定电压(AC):-;电路结构:单刀双掷;安装方式:卧插;机械寿命:5000;滑钮形状:矩形柱状;引脚样式:PC引脚;工作温度:-;开关高度:8.8mm;; LCSC Part Name: 3脚2二档位SK12D07VG4滑动开关1P2T卧式拨动开关; Supplier Part: C393937; Manufacturer: SHOU HAN(首韩); Supplier Footprint: 插件; JLCPCB Part Class: Extended Part; Datasheet: https://atta.szlcsc.com/upload/public/pdf/source/20190521/C393937_939FE26E571CC67D2D532E953108A1B0.pdf; Supplier: LCSC; Current Rating (DC): 500mA; Voltage Rating (DC): 50V; Circuit: 单刀双掷; Mounting Style: 卧插; Mechanical Life: 5000; Actuator Style: 矩形柱状; Pin Style: PC引脚; Switch Height: 8.8mm
U5 = UC3842B: LCSC Part Name: 开关电源芯片; Supplier Part: C347459; Manufacturer: UMW(友台半导体); Supplier Footprint: SOP-8; JLCPCB Part Class: Extended Part; Datasheet: https://atta.szlcsc.com/upload/public/pdf/source/20220426/C35D2DD670428472EB72B0416CC08AB7.pdf; Supplier: LCSC
U8 = MC34152DG: MC34152/MC33152 是双路非逆向高速驱动器，专门设计用于需要低电流数字信号以高压摆率驱动大电容负载的应用。这些器件具有低输入电流因此可兼容 CMOS/LSTTL 逻辑，输入迟滞实现快速输出开关而不受输入转换时间影响，还有两路高电流图腾柱输出，极其适用于驱动功率 MOSFET。另外还包括带有迟滞的欠压锁定，以防系统在低电源电压下错误运行。典型应用包括开关电源、DC-DC 转换器、电容电荷泵倍压器/逆变器和电机控制器。此器件采用双列直插和表面贴装封装。; Supplier Part: C236137; Manufacturer: onsemi(安森美); Supplier Footprint: SOIC-8_150mil; JLCPCB Part Class: Extended Part; Datasheet: https://atta.szlcsc.com/upload/public/pdf/source/20181113/C236137_C17D0EAAFF06BB1704B541C92D239A78.pdf; Supplier: LCSC
U9 = HT7533-1_C14289: 最大输入电压:30V;压降(max):55mV @ 1mA;输出电压(可调):-;静态电流(Iq):-;输出类型:固定;输出电压(固定):3.3V;; Supplier Part: C14289; Manufacturer: HOLTEK(合泰/盛群); Supplier Footprint: SOT-89(SOT-89-3); JLCPCB Part Class: Basic Part; Datasheet: https://atta.szlcsc.com/upload/public/pdf/source/20181207/C14289_D78E082B35DEDE5490CAD08F2F04979D.pdf; Supplier: LCSC
U10 = π120U30: 隔离器的技术构架:iDivider;类型:-;通道数:2;通道类型:-;隔离电压:3000Vrms;数据速率:150kbps;; Supplier Part: C471591; Manufacturer: 2Pai Semi(荣湃); Supplier Footprint: SOIC_N-8; JLCPCB Part Class: Extended Part; Datasheet: https://atta.szlcsc.com/upload/public/pdf/source/20191223/C471591_9DDA368AD43F7C883B9234AAB1EBD9C5.pdf; Supplier: LCSC; Technology: iDivider; Isolated Power: NO; Number of Channels: 2; Inputs - Side 1/Side 2: 2/0; Voltage - Isolation: 3000Vrms; Data Rate: 150kbps; Voltage - Supply: 3.0V-5.5V

## Nets
+3.3V: BUZZER1.1(+) C6.1 C7.1 CN5.4 CN6.4 CN7.4 CN8.4 CN9.5 FH3.1 L2.1 R6.1 R7.2 R10.2 R17.2 U2.4(FB) U6.8(VCC) U10.1(VDD1)
+3.3V_A: C19.2 U9.3(Vout) U10.8(VDD2)
+5V: C1.1 C2.1 C13.1 C17.2 FH4.1 L1.1 R16.1 R27.2 SW2.1 U1.4(FB) U5.8(VREF)
AGND: C5.1 C10.1 C15.1 CN1.1 CN2.1 D2.2 D8.2 D12.1 D15.1 Q6.3(S) Q8.3(S) R3.2 R4.2 R12.1 R23.1 R26.1 U8.3(GND) U10.5(GND2)
GND: C1.2 C2.2 C3.2 C4.1 C6.2 C7.2 C8.2 C9.1 C11.2 C12.2 C13.2 C14.1 C16.1 C17.1 C18.1 C19.1 CN3.1(-) CN5.1 CN6.1 CN7.1 CN8.1 CN9.1 D1.2 D3.2 H1.1 H1.6 H2.4 H2.5 H2.7 H2.10 LED1.2(K) LED2.2(K) LED3.1(K) LED4.2(-) Q1.2(E) Q2.2(E) Q3.2(E) Q4.2(E) R3.1 R4.1 R13.2 R14.2 R28.2 SW2.3 U1.3(GND) U1.6(GND) U2.3(GND) U2.6(GND) U5.5(GND) U6.4(GND) U9.1(GND) U10.4(GND1)
BAT: C3.1 C4.2 C8.1 C9.2 C10.2 C14.2 C18.2 CN5.5 CN6.5 CN7.5 CN8.5 CN9.6 D6.2(A) FH2.2 R8.2 U1.2(VIN) U2.2(VIN) U5.7(VCC) U8.6(VCC) U9.2(Vin)
BAT_IN: CN4.2(+) SW1.3 SW1.4
BAT_VOL: H2.2 R8.1 R14.1 U6.6(INB-)
CAP_OUT: D10.4 D11.4 FH1.2 U3.2 U3.3 U4.1 U4.4
CAP_VOL: C5.2 D2.1 H2.12 R5.1 R12.2 U6.3(INA+)
CHARGED: R7.1 R19.2 U6.1(OUTA)
CHARGING: Q2.3(C) Q3.3(C) Q4.3(C) R18.2 U5.1(COMP)
CHIP: H2.6 U10.3(VIB)
CHIP_ISO: R21.1 U8.4(INPUTB) U10.6(VOB)
CHIP_VCC: D12.2 Q8.1(G) U8.5(OUTPUTB)
COIL_CHIP: D11.1 D11.3 Q8.4(D) U4.2 U4.3
COIL_SHOOT: D10.1 D10.3 Q6.4(D) U3.1 U3.4
CURRENT_CHARGE: C15.2 R25.2 U5.3(ISENSE)
FB_CHARGE: R22.1 R23.2 U5.2(FB)
I2C1_SCL: CN5.2 CN6.2 CN7.2 CN8.2 CN9.3 H1.4
I2C1_SDA: CN5.3 CN6.3 CN7.3 CN8.3 CN9.4 H1.5
IR: CN9.2 H1.2
PWM_CHARGE: D9.1 Q5.1(G) R24.1 U5.6(OUT)
SHOOT: H2.8 U10.2(VIA)
SHOOT_ISO: R20.1 U8.2(INPUTA) U10.7(VOA)
SHOOT_VCC: D15.2 Q6.1(G) U8.7(OUTPUTA)
VCAP+: CN1.2 CN2.2 D7.1(K) FH1.1 R5.2 R22.2
VREF: R6.2 R13.1 U6.2(INA-) U6.5(INB+)
$1N2614: D1.1 L1.2 U1.1(OUTPUT)
$1N8692: D3.1 L2.2 U2.1(OUTPUT)
$1N26351: FH2.1 SW1.1 SW1.2
$1N34053: CN3.2(+) CN4.1(-)
$1N39970: LED1.1(A) R16.2
$1N40345: LED2.1(A) R17.1
$1N43266: FH3.2 H2.1 H2.3
$1N46231: LED4.1(+) R19.1
$1N51147: R10.1 R11.1 U6.7(OUTB)
$1N51590: BUZZER1.2(-) Q1.3(C)
$1N51883: Q1.1(B) R11.2
$1N54201: FH4.2 H2.9 H2.11
$1N55258: LED3.2(A) R18.1
$2N3644: D5.1(K) R21.2
$2N3782: C12.1 D5.2(A) Q3.1(B)
$2N4435: D4.1(K) R20.2
$2N4437: C11.1 D4.2(A) Q2.1(B)
$2N14178: D9.2 Q5.3(S) R24.2 R25.1 R26.2
$2N14601: D6.1(K) D8.1 L3.1
$2N15274: D7.2(A) L3.2 Q5.2(D)
$2N27199: C16.2 R27.1 U5.4(RT/CT)
$2N46487: Q4.1(B) R28.1 R29.1
$2N46490: R29.2 SW2.2

Not connected (* = marked no-connect by the designer): CN3 3 4; CN4 3 4; D7 3*; H1 3; SW2 4* 5*; U1 5(ON_OFF)*; U2 5(ON_OFF)*; U8 1(NC) 8(NC)
